# Altium schematic sheet Sheet1.SchDoc
size A4
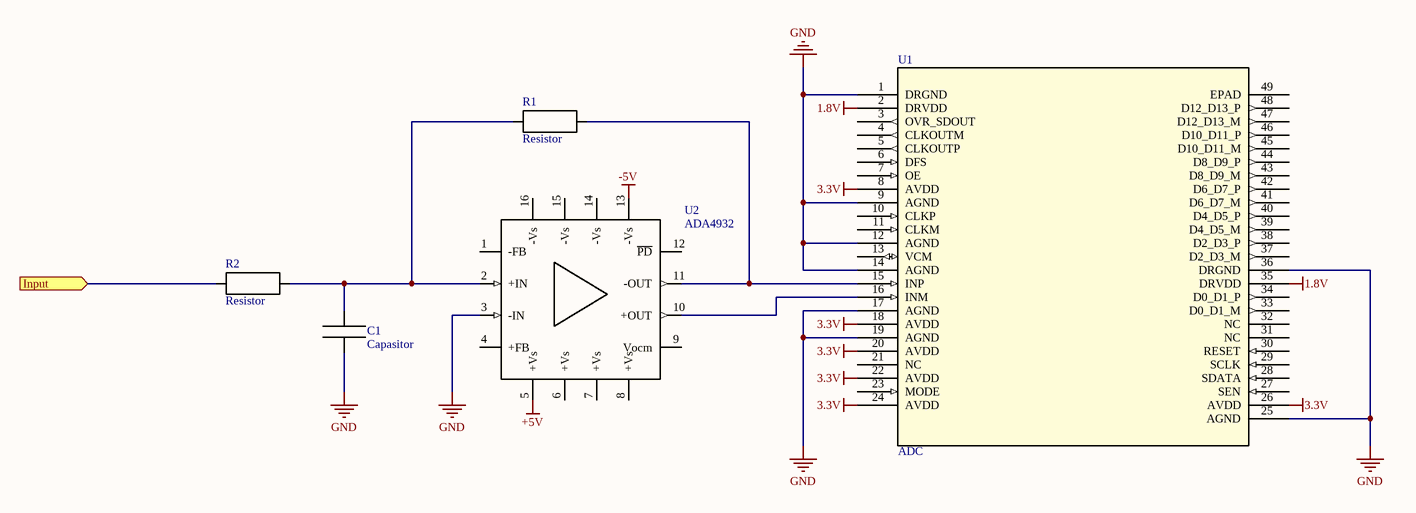
[diagram p0: Sheet1.SchDoc]

## Parts
C1  Capasitor
R1  Resistor  [Resistor]
R2  Resistor  [Resistor]
U1  ADC  [ADC]
U2  ADA4932  [AD]

## Ports
Input (in)

## Nets
1.8V: U1.2(DRVDD) U1.35(DRVDD)
3.3V: U1.8(AVDD) U1.18(AVDD) U1.20(AVDD) U1.22(AVDD) U1.24(AVDD) U1.26(AVDD)
+5V: U2.5(+Vs)
-5V: U2.13(-Vs)
GND: C1.0 U1.1(DRGND) U1.9(AGND) U1.12(AGND) U1.14(AGND) U1.17(AGND) U1.19(AGND) U1.25(AGND) U1.36(DRGND) U2.3(-IN)
Input: R2.1 ; port Input
NetC1_1: C1.1 R1.1 R2.2 U2.2(+IN)
NetR1_2: R1.2 U1.15(INP) U2.11(-OUT)
NetU1_16: U1.16(INM) U2.10(+OUT)

Not connected (* = marked no-connect by the designer): U1 3(OVR_SDOUT) 4(CLKOUTM) 5(CLKOUTP) 6(DFS) 7(OE) 10(CLKP) 11(CLKM) 13(VCM) 21(NC) 23(MODE) 27(SEN) 28(SDATA) 29(SCLK) 30(RESET) 31(NC) 32(NC) 33(D0_D1_M) 34(D0_D1_P) 37(D2_D3_M) 38(D2_D3_P) 39(D4_D5_M) 40(D4_D5_P) 41(D6_D7_M) 42(D6_D7_P) 43(D8_D9_M) 44(D8_D9_P) 45(D10_D11_M) 46(D10_D11_P) 47(D12_D13_M) 48(D12_D13_P) 49(EPAD); U2 1(-FB) 4(+FB) 6(+Vs) 7(+Vs) 8(+Vs) 9(Vocm) 12(~{PD}) 14(-Vs) 15(-Vs) 16(-Vs)